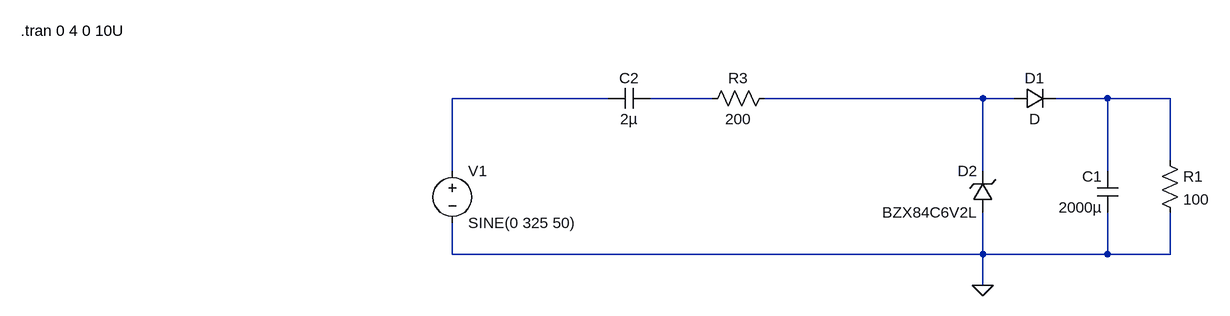
[diagram p0: schematic converter_halfwave.asc]
converter_halfwave.asc, the LTspice schematic file:
Version 4
SHEET 1 880 680
WIRE -128 64 -368 64
WIRE 32 64 -64 64
WIRE 448 64 112 64
WIRE 496 64 448 64
WIRE 640 64 560 64
WIRE 736 64 640 64
WIRE 736 160 736 64
WIRE -368 176 -368 64
WIRE 448 176 448 64
WIRE 640 176 640 64
WIRE -368 304 -368 256
WIRE 448 304 448 240
WIRE 448 304 -368 304
WIRE 640 304 640 240
WIRE 640 304 448 304
WIRE 736 304 736 240
WIRE 736 304 640 304
WIRE 448 352 448 304
FLAG 448 352 0
SYMBOL voltage -368 160 R0
WINDOW 123 0 0 Left 0
WINDOW 39 0 0 Left 0
SYMATTR InstName V1
SYMATTR Value SINE(0 325 50)
SYMBOL diode 496 80 R270
WINDOW 0 32 32 VTop 2
WINDOW 3 0 32 VBottom 2
SYMATTR InstName D1
SYMBOL zener 464 240 R180
WINDOW 0 24 64 Left 2
WINDOW 3 24 0 Left 2
SYMATTR InstName D2
SYMATTR Value BZX84C6V2L
SYMATTR Description Diode
SYMATTR Type diode
SYMBOL cap 656 240 R180
WINDOW 0 24 56 Left 2
WINDOW 3 24 8 Left 2
SYMATTR InstName C1
SYMATTR Value 2000µ
SYMATTR SpiceLine IC 5
SYMBOL cap -64 48 R90
WINDOW 0 0 32 VBottom 2
WINDOW 3 32 32 VTop 2
SYMATTR InstName C2
SYMATTR Value 2µ
SYMBOL res 128 48 R90
WINDOW 0 0 56 VBottom 2
WINDOW 3 32 56 VTop 2
SYMATTR InstName R3
SYMATTR Value 200
SYMBOL res 720 144 R0
SYMATTR InstName R1
SYMATTR Value 100
TEXT -1032 -40 Left 2 !.tran 0 4 0 10U

The netlist it stands for:
* converter_halfwave.asc
V1 N001 0 SINE(0 325 50)
D1 N003 N004 D
D2 0 N003 BZX84C6V2L
C1 0 N004 2000µ IC 5
C2 N002 N001 2µ
R3 N003 N002 200
R1 N004 0 100
.model D D
.lib standard.dio
.tran 0 4 0 10U
.backanno
.end